# EAGLE design single_v4 (EAGLE 8.1.0)
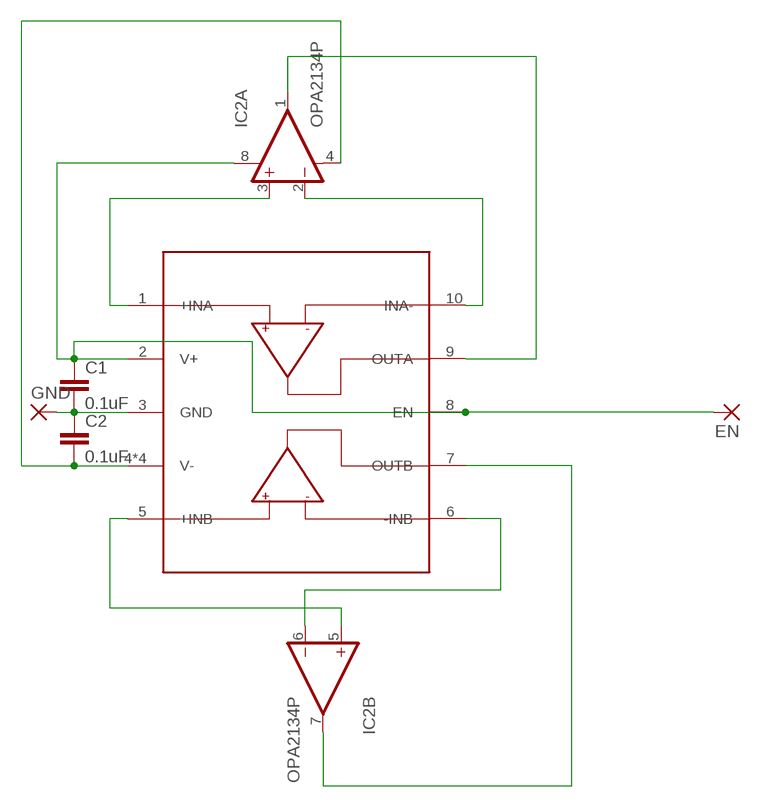
[diagram p0: schematic, sheet 1]

## Parts
C1  0.1uF  C-EUC0805  [C0805]
C2  0.1uF  C-EUC0805  [C0805]
EN  1,6/0,8  [1,6/0,8]
GND  1,6/0,8  [1,6/0,8]
IC1  OPA1622  [S-PDSO-N10]
IC2  OPA2134P  [DIL08]

## Nets
+INA: IC1.1(+INA) IC2.3(A:+IN)
+INB: IC1.5(+INB) IC2.5(B:+IN)
-INA: IC1.10(INA-) IC2.2(A:-IN)
-INB: IC1.6(-INB) IC2.6(B:-IN)
GND: C1.2 C2.1 GND.1(P) IC1.3(GND)
OUTA: IC1.9(OUTA) IC2.1(A:OUT)
OUTB: IC1.7(OUTB) IC2.7(B:OUT)
V+: C1.1 EN.1(P) IC1.2(V+) IC1.8(EN) IC2.8(A:V+)
V-: C2.2 IC1.4(V-) IC1.PP(V-) IC1.PP@1(V-) IC1.PP@2(V-) IC2.4(A:V-)

## Library data of the parts
C1 C2 = resistor:C-EU: CAPACITOR, European symbol
EN GND = wirepad:1,6/0,8: THROUGH-HOLE PAD
IC1 = texas:OPA1622: Operational Amplifier, Audio
IC2 = myparts:OPA2134: Operational Amplifier; MF: TEXAS INSTRUMENTS; MPN: OPA2134PA; OC_FARNELL: 1097574; OC_NEWARK: 74K3897

## Net classes
0 default: clearance 0.205 mm

## Board
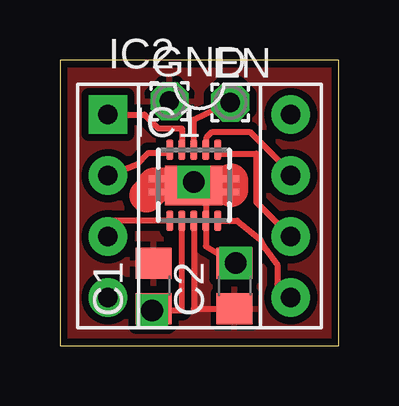
[diagram p1: board, top side]
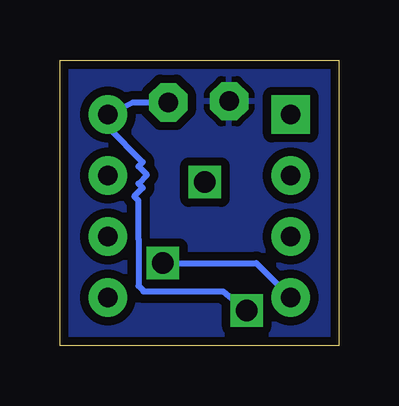
[diagram p2: board, bottom side, seen from below]

Size 11.63 x 11.9 mm. Coordinates in mm from the lower left corner, seen from the top.
Outline: 0,0 11.63,0 11.63,11.9 0,11.9 0,0
Copper layers (1*16): Top 0.035mm / dielectric 1.5mm / Bottom 0.035mm
Design rules "dirt_cheap_dirty_boards.v1": minimum track width 5mil, minimum drill 12mil, track to track 5mil, track to pad 5mil, pad to pad 5mil, via to via 5mil, smd to smd 0mil, copper to edge 10mil, drill to drill 10mil, minimum pad ring 10mil, minimum via ring 6mil, stop-mask expansion 2mil, vias tented up to drill 25mil, thermal gap 10mil

### Footprints (pad centres in the part's own frame; a part is rotated, then mirrored left to right if it is on the bottom)
C0805 = smd 1.3 x 1.5: 1 -0.95,0; 2 0.95,0
1,6/0,8 = drill 0.813 pad 1.6 octagon: 1 0,0
S-PDSO-N10 = smd 0.28 x 0.85: 1 -1,-1.475; 2 -0.5,-1.475; 3 0,-1.475; 4 0.5,-1.475; 5 1,-1.475; 6 1,1.475; 7 0.5,1.475; 8 0,1.475; 9 -0.5,1.475; 10 -1,1.475 | smd 2.4 x 1.65: PP 0,0 | smd 3.8 x 0.28: PP@1 0,0.275; PP@2 0,-0.275
DIL08 = drill 0.813 pad 1.6 square: 1 -3.81,-3.81 | drill 0.813 pad 1.6: 2 -1.27,-3.81; 3 1.27,-3.81; 4 3.81,-3.81; 5 3.81,3.81; 6 1.27,3.81; 7 -1.27,3.81; 8 -3.81,3.81

### Placement (x,y rotation side)
C1  3.91,2.49 90 top
C2  7.29,2.49 90 top
EN  7.11,10.13 0 top
GND  4.57,10.19 0 top
IC1  5.59,6.68 0 top
IC2  5.82,5.82 270 top

### Tracks (layer width: path | path; a pad name or v marks a point on that pad's centre or on a via)
+INA
  Top 0.254: IC1.1 2.01,5.21 IC2.3
+INB
  Top 0.254: IC1.5 7.39,5.21 8.37,4.4 8.55,4.08 9.07,3.38 9.07,2.56 IC2.5
-INA
  Top 0.254: IC2.2 3.21,7.55 3.69,8.03 4.44,8.03 IC1.10
-INB
  Top 0.254: IC1.6 6.74,8 8.18,8 8.18,5.99 IC2.6
GND
  Top 0.254: IC1.3 5.59,1.54 C2.1
  pour Bottom (isolate 0.356): 0,11.91 0,0 11.73,0 11.73,11.91
  pour Top (isolate 0.305): 0,11.91 11.73,11.91 11.73,0 0,0
OUTA
  Top 0.254: IC2.1 3.53,9.63 4.1,9.05 5.09,9.05 IC1.9
OUTB
  Top 0.254: IC1.7 6.12,8.18 6.12,8.68 6.35,8.91 7.92,8.91 9.63,7.2 IC2.7
V+  (via drill 0.9)
  Top 0.254: EN.1 5.59,9.42 IC1.8 | IC1.2 5.09,1.48 3.91,1.48 C1.1 | C1.1 3.84,1.47 v3.84,1.46 | C1.1 3.62,1.25 3.38,1.25
  Bottom 0.254: IC2.8 8.59,10.13 EN.1 | v3.84,1.46 4.82,2.26 8.15,2.26 8.15,2.28 8.36,2.49 8.36,4.45 8.36,6.04 8.53,6.22 8.18,6.58 8.36,6.76 8,7.11 8.36,7.47 8.18,7.64 9.63,9.09 IC2.8 | IC2.8 9.63,9.45
V-  (via drill 0.9)
  Top 0.127: v5.59,6.82 5.64,6.81 IC1.PP
  Top 0.254: 5.77,6.47 IC1.PP@2 IC1.PP | v7.34,3.44 7.47,3.44 C2.2 6.09,4.15 IC1.4 6.09,5.87 5.59,6.37 IC1.PP | IC1.PP@1 v5.59,6.82 IC1.PP
  Top 1.422: 3.6,6.25 3.93,6.58 3.93,6.71 5.56,6.71 IC1.PP 5.66,6.76 7.14,6.76 | 7.14,6.76 7.14,6.48 | 7.14,6.76 7.14,6.88
  Bottom 0.254: IC2.4 3.44,3.44 v7.34,3.44